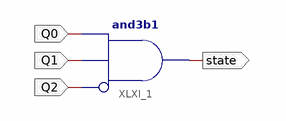
[diagram p0: schematic sheet 1]
// Xilinx ISE schematic StateDec.sch (spartan3e) as structural Verilog: 1 symbols, 4 ports
module StateDec (
  input  Q0,
  input  Q1,
  input  Q2,
  output state
);

  and XLXI_1 (state, ~Q2, Q1, Q0);  // and3b1
endmodule
